# EAGLE schematic star-tracker-camera-breakout (EAGLE 9.6.2)
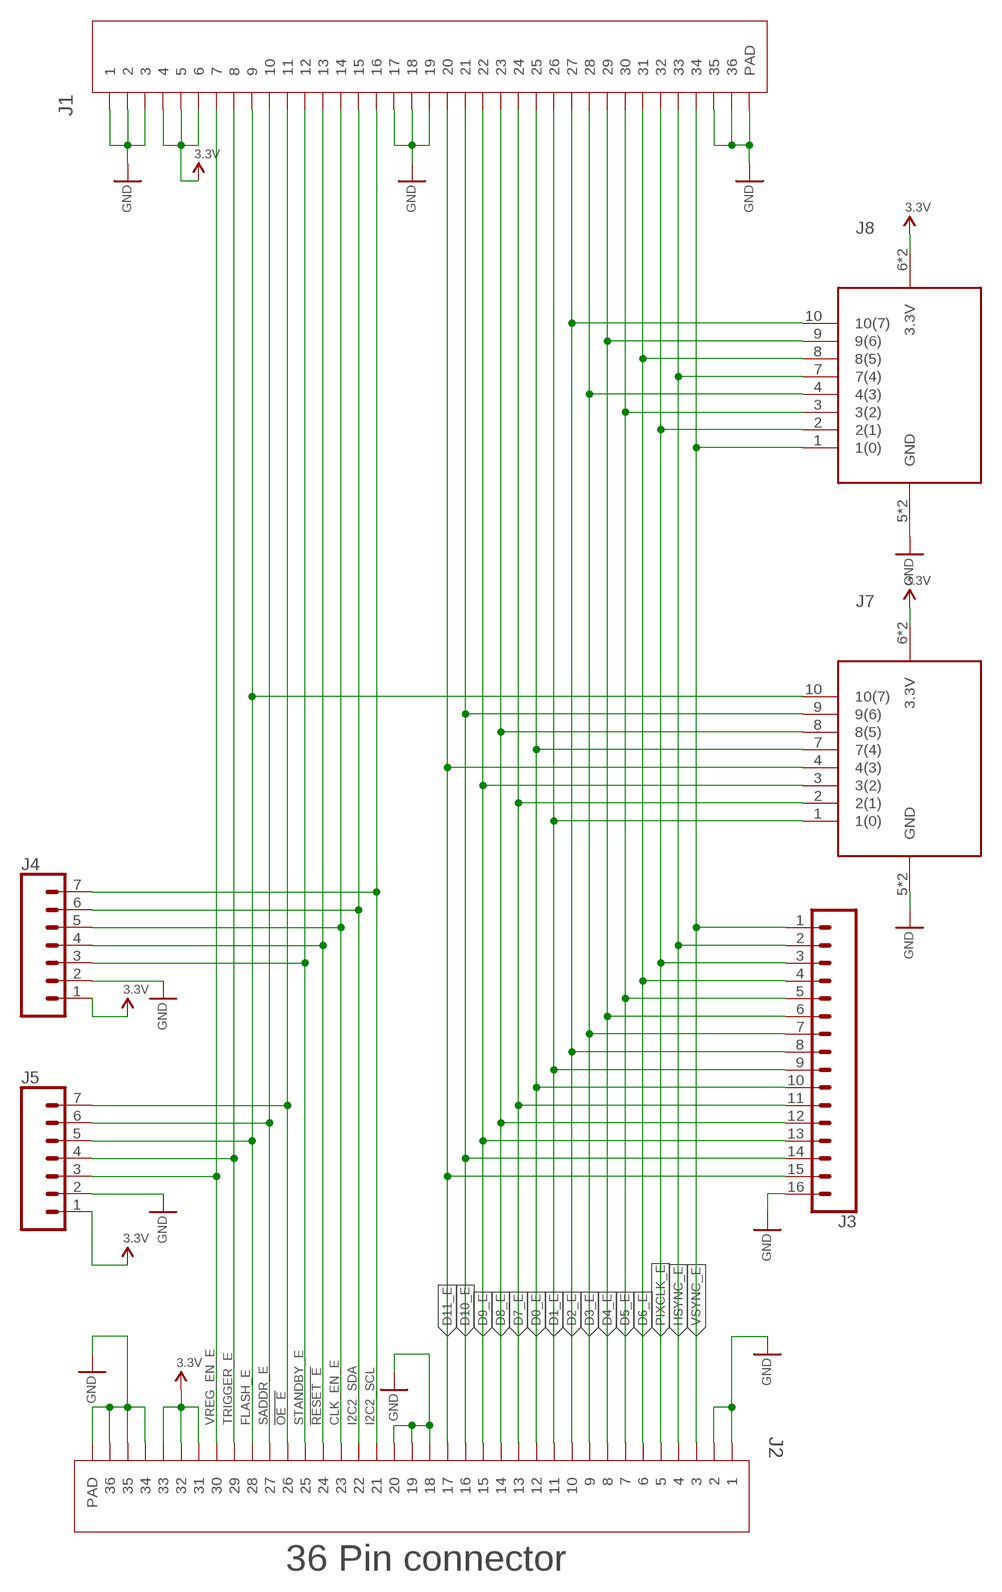
[diagram p0: schematic, sheet 1]

## Parts
J1  3-1734592-64-1734592-0  [TE_3-1734592-6]
J2  3-1734592-64-1734592-0  [TE_3-1734592-6]
J3  CONN_16  [1X16]
J4  CONN_07  [1X07]
J5  CONN_07  [1X07]
J7  2X6 FEMALE  PMOD_PERIPHPTH_FEMALE  [PMOD_PERIPH]
J8  2X6 FEMALE  PMOD_PERIPHPTH_FEMALE  [PMOD_PERIPH]

## Nets
3.3V: J1.4 J1.5 J1.6 J2.31 J2.32 J2.33 J4.1 J5.1 J7.6(3.3V) J7.12(3.3V) J8.6(3.3V) J8.12(3.3V)
!OE_E: J1.11 J2.26 J5.7
!RESET_E: J1.13 J2.24 J4.4
CLK_EN_E: J1.14 J2.23 J4.5
D0_E: J1.25 J2.12 J3.10 J7.7(7(4))
D1_E: J1.26 J2.11 J3.9 J7.1(1(0))
D2_E: J1.27 J2.10 J3.8 J8.10(10(7))
D3_E: J1.28 J2.9 J3.7 J8.4(4(3))
D4_E: J1.29 J2.8 J3.6 J8.9(9(6))
D5_E: J1.30 J2.7 J3.5 J8.3(3(2))
D6_E: J1.31 J2.6 J3.4 J8.8(8(5))
D7_E: J1.24 J2.13 J3.11 J7.2(2(1))
D8_E: J1.23 J2.14 J3.12 J7.8(8(5))
D9_E: J1.22 J2.15 J3.13 J7.3(3(2))
D10_E: J1.21 J2.16 J3.14 J7.9(9(6))
D11_E: J1.20 J2.17 J3.15 J7.4(4(3))
FLASH_E: J1.9 J2.28 J5.5 J7.10(10(7))
GND: J1.1 J1.2 J1.3 J1.17 J1.18 J1.19 J1.35 J1.36 J1.S1(PAD) J1.S2(PAD) J2.1 J2.2 J2.18 J2.19 J2.20 J2.34 J2.35 J2.36 J2.S1(PAD) J2.S2(PAD) J3.16 J4.2 J5.2 J7.5(GND) J7.11(GND) J8.5(GND) J8.11(GND)
HSYNC_E: J1.33 J2.4 J3.2 J8.7(7(4))
I2C2_SCL: J1.16 J2.21 J4.7
I2C2_SDA: J1.15 J2.22 J4.6
PIXCLK_E: J1.32 J2.5 J3.3 J8.2(2(1))
SADDR_E: J1.10 J2.27 J5.6
STANDBY_E: J1.12 J2.25 J4.3
TRIGGER_E: J1.8 J2.29 J5.4
VREG_EN_E: J1.7 J2.30 J5.3
VSYNC_E: J1.34 J2.3 J3.1 J8.1(1(0))

## Notes on the sheet
- 36 Pin connector

## Library data of the parts
J1 J2 = J-TEConnectivity-X-1734592-X:3-1734592-6; DPN: A100291CT-ND; MPN: 3-1734592-6
J3 = SparkFun-Connectors:CONN_16: Multi connection point. Often used as Generic Header-pin footprint for 0.1 inch spaced/style header connections On any of the 0.1 inch spaced packages, you can populate with these: Break Away Headers - Straight <https://www.sparkfun.com/products/116> (PRT-00116) Break Away Male Headers - Right Angle <https://www.sparkfun.com/products/553> (PRT-00553) Female Headers <https://www.sparkfun.com/products/115> (PRT-00115) Break Away Headers - Machine Pin <https://www.sparkfun.com/products/117> (PRT-00117) Break Away Female Headers - Swiss Machine Pin <https://www.sparkfun.com/products/743> (PRT-00743) For SCREWTERMINALS and SPRING TERMINALS visit here: Screw Terimnals on SparkFun.com <https://www.sparkfun.com/search/results?term=Screw+Terminals> (5mm/3.5mm/2.54mm spacing) This device is also useful as a general connection point to wire up your design to another part of your project. Our various solder wires solder well into these plated through hole pads. Hook-Up Wire - Assortment (Stranded, 22 AWG) <https://www.sparkfun.com/products/11375> (PRT-11375) Hook-Up Wire - Assortment (Solid Core, 22 AWG) <https://www.sparkfun.com/products/11367> (PRT-11367) View the entire wire category on our website here <https://www.sparkfun.com/categories/141> Special notes: Molex polarized connector foot print use with SKU : PRT-08231 with associated crimp pins and housings. 1MM SMD Version SKU: PRT-10208 NOTES ON THE VARIANTS LOCK and LOCK_LONGPADS... This footprint was designed to help hold the alignment of a through-hole component (i.e. 6-pin header) while soldering it into place. You may notice that each hole has been shifted either up or down by 0.005 of an inch from it's more standard position (which is a perfectly straight line). This slight alteration caused the pins (the squares in the middle) to touch the edges of the holes. Because they are alternating, it causes a "brace" to hold the component in place. 0.005 has proven to be the perfect amount of "off-center" position when using our standard breakaway headers. Although looks a little odd when you look at the bare footprint, once you have a header in there, the alteration is very hard to notice. Also,if you push a header all the way into place, it is covered up entirely on the bottom side.
J4 J5 = SparkFun-Connectors:CONN_07: Multi connection point. Often used as Generic Header-pin footprint for 0.1 inch spaced/style header connections On any of the 0.1 inch spaced packages, you can populate with these: Break Away Headers - Straight <https://www.sparkfun.com/products/116> (PRT-00116) Break Away Male Headers - Right Angle <https://www.sparkfun.com/products/553> (PRT-00553) Female Headers <https://www.sparkfun.com/products/115> (PRT-00115) Break Away Headers - Machine Pin <https://www.sparkfun.com/products/117> (PRT-00117) Break Away Female Headers - Swiss Machine Pin <https://www.sparkfun.com/products/743> (PRT-00743) For SCREWTERMINALS and SPRING TERMINALS visit here: Screw Terimnals on SparkFun.com <https://www.sparkfun.com/search/results?term=Screw+Terminals> (5mm/3.5mm/2.54mm spacing) This device is also useful as a general connection point to wire up your design to another part of your project. Our various solder wires solder well into these plated through hole pads. Hook-Up Wire - Assortment (Stranded, 22 AWG) <https://www.sparkfun.com/products/11375> (PRT-11375) Hook-Up Wire - Assortment (Solid Core, 22 AWG) <https://www.sparkfun.com/products/11367> (PRT-11367) View the entire wire category on our website here <https://www.sparkfun.com/categories/141> Special notes: Molex polarized connector foot print use with SKU : PRT-08231 with associated crimp pins and housings. 1MM SMD Version SKU: PRT-10208 NOTES ON THE VARIANTS LOCK and LOCK_LONGPADS... This footprint was designed to help hold the alignment of a through-hole component (i.e. 6-pin header) while soldering it into place. You may notice that each hole has been shifted either up or down by 0.005 of an inch from it's more standard position (which is a perfectly straight line). This slight alteration caused the pins (the squares in the middle) to touch the edges of the holes. Because they are alternating, it causes a "brace" to hold the component in place. 0.005 has proven to be the perfect amount of "off-center" position when using our standard breakaway headers. Although looks a little odd when you look at the bare footprint, once you have a header in there, the alteration is very hard to notice. Also,if you push a header all the way into place, it is covered up entirely on the bottom side.
J7 J8 = PMOD:PMOD_PERIPH: Multi connection point. Often used as Generic Header-pin footprint for 0.1 inch spaced/style header connections On any of the 0.1 inch spaced packages, you can populate with these: Break Away Headers - Straight <https://www.sparkfun.com/products/116> (PRT-00116) Break Away Male Headers - Right Angle <https://www.sparkfun.com/products/553> (PRT-00553) Female Headers <https://www.sparkfun.com/products/115> (PRT-00115) Break Away Headers - Machine Pin <https://www.sparkfun.com/products/117> (PRT-00117) Break Away Female Headers - Swiss Machine Pin <https://www.sparkfun.com/products/743> (PRT-00743); PROD_ID: CONN-12423